# EAGLE schematic humming (EAGLE 9.4.2)
DK-PN: DNP
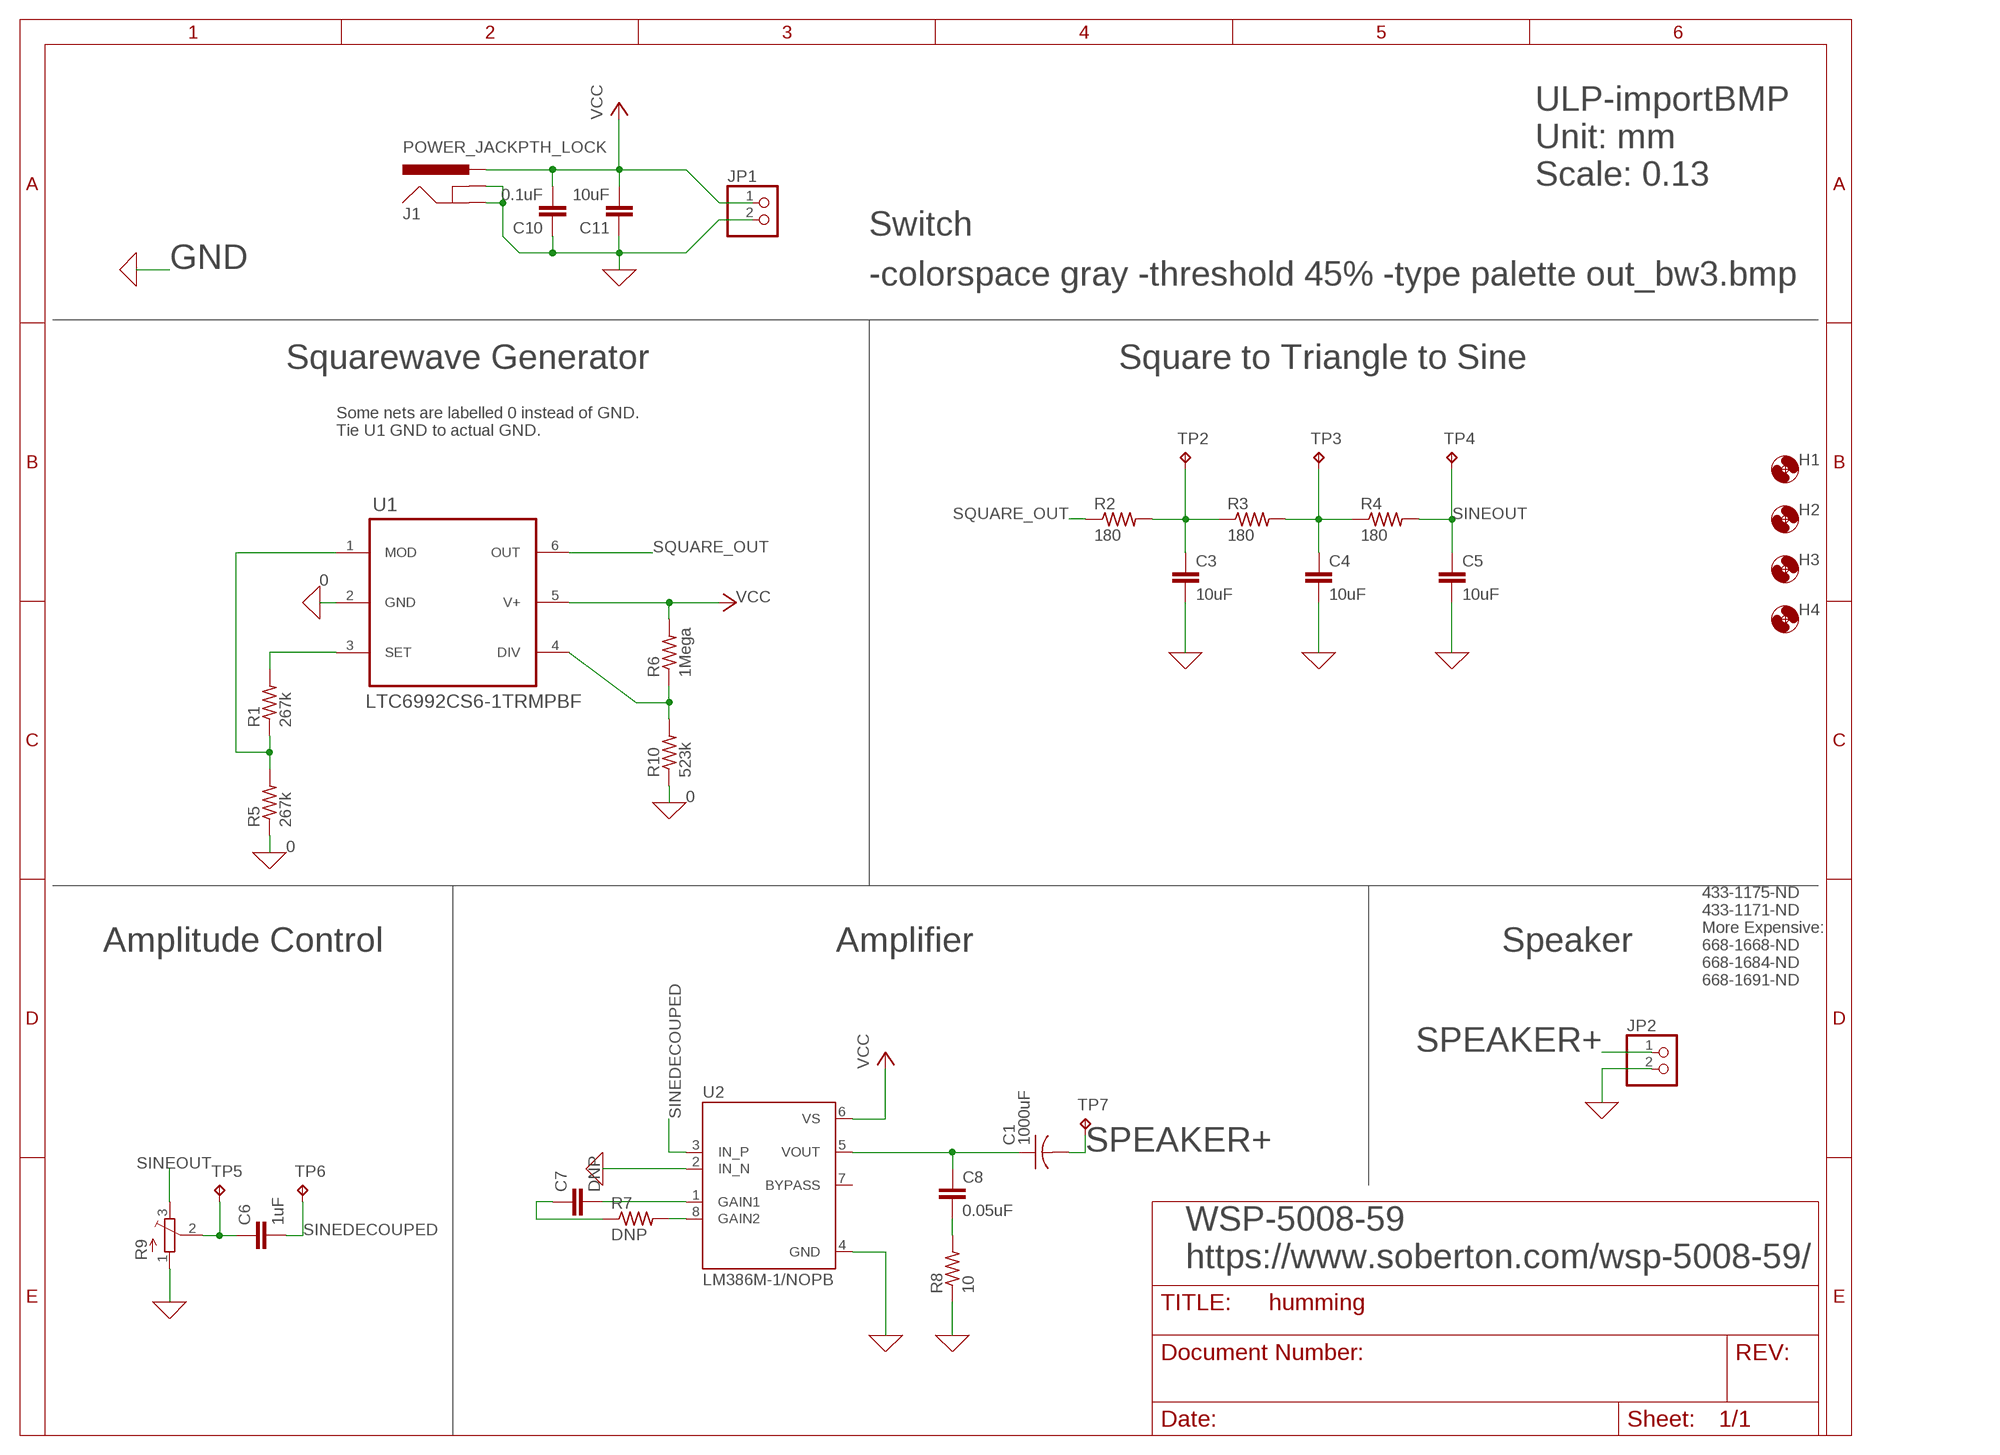
[diagram p0: schematic, sheet 1]

## Parts
C1  1000uF  EDT108M010S9PAA  [CAPAE1030X1050N]
C3  10uF  C-EUC0805  [C0805]
C4  10uF  C-EUC0805  [C0805]
C5  10uF  C-EUC0805  [C0805]
C6  1uF  C-EUC0603  [C0603]
C7  DNP  C-EUC0603  [C0603]
C8  0.05uF  C-EUC0603  [C0603]
C10  0.1uF  C-EUC1206  [C1206]
C11  10uF  C-EUC1206  [C1206]
H1  MOUNT-HOLE2.8  [2,8]
H2  MOUNT-HOLE2.8  [2,8]
H3  MOUNT-HOLE2.8  [2,8]
H4  MOUNT-HOLE2.8  [2,8]
J1  POWER_JACKPTH_LOCK  [POWER_JACK_PTH_LOCK]
JP1  PINHD-1X2  [1X02]
JP2  PINHD-1X2  [1X02]
R1  267k  R-US_R0603  [R0603]
R2  180  R-US_R0603  [R0603]
R3  180  R-US_R0603  [R0603]
R4  180  R-US_R0603  [R0603]
R5  267k  R-US_R0603  [R0603]
R6  1Mega  R-US_R0603  [R0603]
R7  DNP  R-US_R0603  [R0603]
R8  10  R-US_R0603  [R0603]
R9  3223W-1-105E  TRIM_EU-3223W  [3223W]
R10  523k  R-US_R0603  [R0603]
TP2  TPB1,27  [B1,27]
TP3  TPB1,27  [B1,27]
TP4  TPB1,27  [B1,27]
TP5  TPB1,27  [B1,27]
TP6  TPB1,27  [B1,27]
TP7  TPB1,27  [B1,27]
U1  LTC6992CS6-1TRMPBF  [SOT95P280X100-6N]
U2  LM386M-1/NOPB  [SOIC127P600X175-8N]

## Nets
0: R5.1 R10.1 U1.2(GND) ; supply symbol labelled GND
GND: C3.2 C4.2 C5.2 C10.1 C11.1 J1.GND J1.GNDBREAK JP1.2 JP2.2 R8.1 R9.1(A) U2.2(IN_N) U2.4(GND)
N$1: C3.1 R2.2 R3.1 TP2.TP
N$2: R1.2 U1.3(SET)
N$3: C4.1 R3.2 R4.1 TP3.TP
N$4: C7.2 U2.1(GAIN1)
N$5: R7.2 U2.8(GAIN2)
N$6: C6.1 R9.2(S) TP5.TP
N$7: C8.2 R8.2
N$8: C7.1 R7.1
N$9: C1.1 C8.1 U2.5(VOUT)
N$10: R1.1 R5.2 U1.1(MOD)
N$12: R6.1 R10.2 U1.4(DIV)
SINEDECOUPED: C6.2 TP6.TP U2.3(IN_P)
SINEOUT: C5.1 R4.2 R9.3(E) TP4.TP
SPEAKER+: C1.2 JP2.1 TP7.TP
SQUARE_OUT: R2.1 U1.6(OUT)
VCC: C10.2 C11.2 J1.PWR JP1.1 R6.2 U1.5(V+) U2.6(VS)
Unconnected: U2.7(BYPASS)

## Notes on the sheet
- ULP-importBMP
  Unit: mm
  Scale: 0.13
- Switch
- -colorspace gray -threshold 45% -type palette out_bw3.bmp
- Squarewave Generator | Square to Triangle to Sine
- Some nets are labelled 0 instead of GND.
  Tie U1 GND to actual GND.
- Amplitude Control | Amplifier | Speaker
- 433-1175-ND
  433-1171-ND
  More Expensive:
  668-1668-ND
  668-1684-ND
  668-1691-ND
- WSP-5008-59
  https://www.soberton.com/wsp-5008-59/

## Library data of the parts
C1 = CAPAE1030X1050N:EDT108M010S9PAA: EDT108M010S9PAA; DK-PN: 399-20518-1-ND; POPULATE: Y
C3-C5 = rcl:C-EU: CAPACITOR, European symbol; DK-PN: 490-14381-1-ND; POPULATE: Y; SPICEPREFIX: C
C6 = rcl:C-EU: CAPACITOR, European symbol; DK-PN: 399-17705-1-ND; POPULATE: Y; SPICEPREFIX: C
C7 = rcl:C-EU: CAPACITOR, European symbol; POPULATE: N; SPICEPREFIX: C
C8 = rcl:C-EU: CAPACITOR, European symbol; DK-PN: 399-14522-1-ND; POPULATE: Y; SPICEPREFIX: C
C10 = rcl:C-EU: CAPACITOR, European symbol; DK-PN: 732-8097-1-ND; POPULATE: Y; SPICEPREFIX: C
C11 = rcl:C-EU: CAPACITOR, European symbol; DK-PN: 399-7012-1-ND; POPULATE: Y; SPICEPREFIX: C
H1-H4 = holes:MOUNT-HOLE: MOUNTING HOLE with drill center marker; POPULATE: N
J1 = Particle:POWER_JACK: Power Jack This is the standard 5.5mm barrel jack for power. The PTH is the most common, proven, reliable, footprint. The Slot footprint only works if the mill layer is transmitted to the PCB fab house so be warned. Spark Fun Electronics SKU : PRT-00119 SMT: CONN-08106 Mating wall wart : TOL-00298 (and others); DK-PN: CP-202A-ND; POPULATE: Y
JP1 = pinhead:PINHD-1X2: PIN HEADER; POPULATE: N
JP2 = pinhead:PINHD-1X2: PIN HEADER; DK-PN: 433-1180-ND; POPULATE: Y
R1 R5 = rcl:R-US_: RESISTOR, American symbol; DK-PN: P267KDBCT-ND; POPULATE: Y; SPICEPREFIX: R
R2-R4 = rcl:R-US_: RESISTOR, American symbol; DK-PN: P180DBCT-ND; POPULATE: Y; SPICEPREFIX: R
R6 = rcl:R-US_: RESISTOR, American symbol; DK-PN: YAG4498CT-ND; POPULATE: Y; SPICEPREFIX: R
R7 = rcl:R-US_: RESISTOR, American symbol; POPULATE: N; SPICEPREFIX: R
R8 = rcl:R-US_: RESISTOR, American symbol; DK-PN: CRT0603-BY-10R0ELFCT-ND; POPULATE: Y; SPICEPREFIX: R
R9 = pot:TRIM_EU-: POTENTIOMETER; DK-PN: 3223W-1-105E; POPULATE: Y
R10 = rcl:R-US_: RESISTOR, American symbol; DK-PN: YAG4758CT-ND; POPULATE: Y; SPICEPREFIX: R
TP2-TP7 = testpad:TP: Test pad; POPULATE: N
U1 = LTC6992CS6-1TRMPBF:LTC6992CS6-1TRMPBF: Voltage-Controlled Pulse Width Modulator (PWM); AVAILABILITY: Unavailable; DESCRIPTION: Silicon Oscillator - 0.00000381MHz to 1MHz CMOS Automotive 6-Pin TSOT-23 T/R; DK-PN: LTC6992CS6-1#TRMPBFCT-ND; MF: Analog Devices; MP: LTC6992CS6-1#TRMPBF; PACKAGE: SOT-23-6 Analog Devices; POPULATE: Y; PRICE: None
U2 = LM386M-1_NOPB:LM386M-1/NOPB: Audio Amplifiers LOW VLTG AUDIO PWR AMP; AVAILABILITY: Unavailable; DESCRIPTION: Amplifier IC 1-Channel _Mono_ Class AB 8-SOIC; DK-PN: LM386MX-1/NOPBCT-ND; MF: Texas Instruments; MP: LM386M-1; PACKAGE: SOIC-8 Texas Instruments; POPULATE: Y; PRICE: None